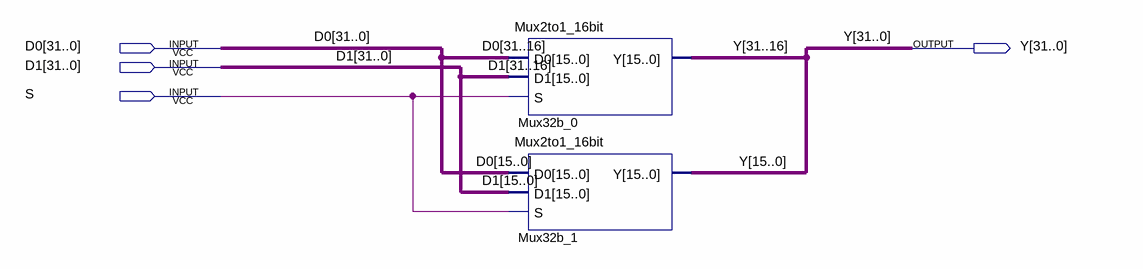
[diagram p0: schematic sheet]
// Quartus schematic Mux2to1_32bit.bdf as structural Verilog: 2 symbols, 4 pins
module Mux2to1_32bit (
  input  [31:0] D0,
  input  [31:0] D1,
  input  S,
  output [31:0] Y
);

  Mux2to1_16bit Mux32b_0 (.D0(D0[31:16]), .D1(D1[31:16]), .S(S), .Y(Y[31:16]));
  Mux2to1_16bit Mux32b_1 (.D0(D0[15:0]), .D1(D1[15:0]), .S(S), .Y(Y[15:0]));
endmodule
